# EasyEDA Pro project ESP32_Dev_Board.epro, board PCB4
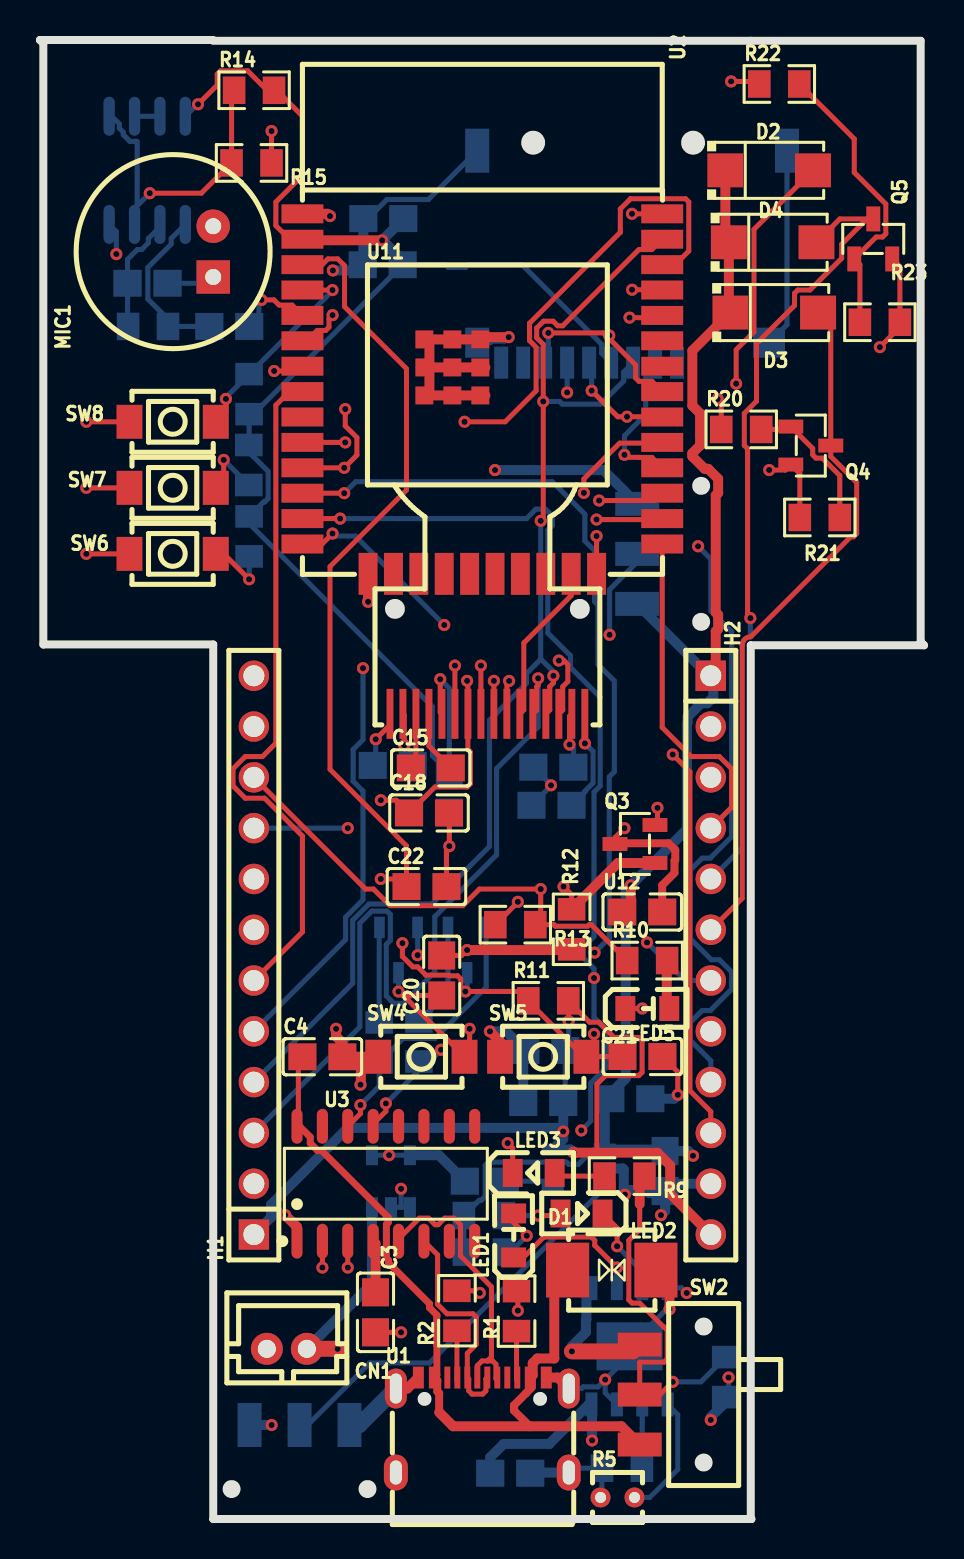
[diagram p1: board, top side]
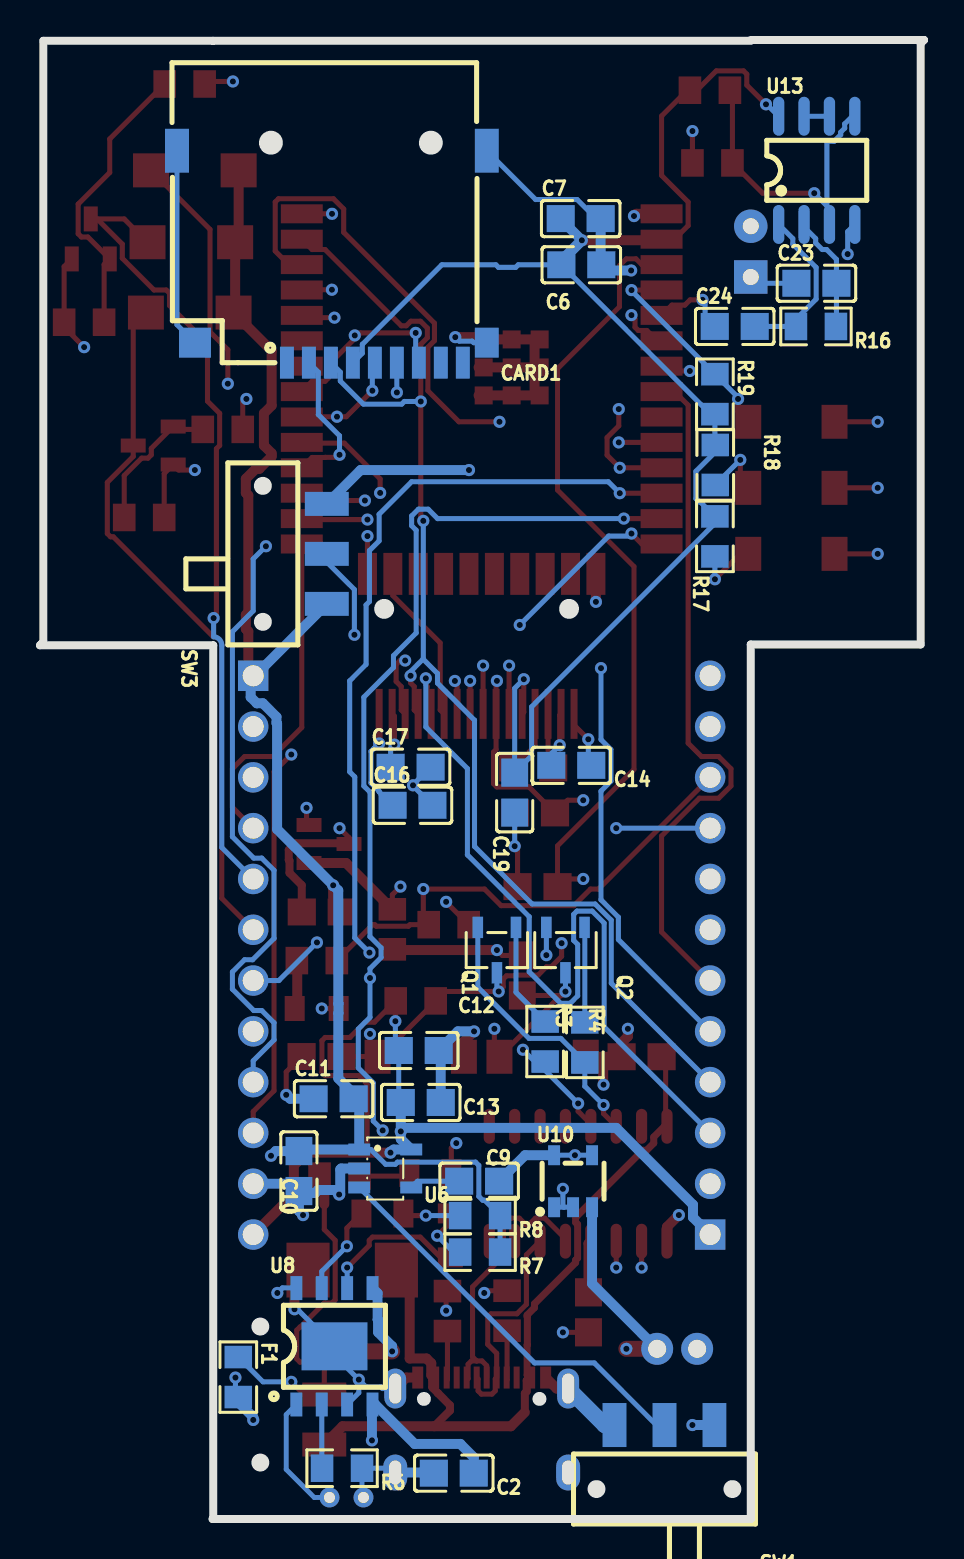
[diagram p2: board, bottom side, seen from below]

Outline 44.23 x 73.95 mm; copper layers: Top Layer, Inner1, Inner2, Bottom Layer. Coordinates in mm from the lower left corner of the outline.
Outline path: 8.67,73.95 0,73.95 0.17,73.79 0.17,43.73 8.67,43.73 8.67,0 35.59,0 35.56,0.03 35.56,43.69 44.23,43.69 44.06,43.86 44.06,73.91 8.67,73.91
Stack: Top Layer 0.035mm Outer layer thickness 1oz / Dielectric1 0.2104mm 7628 RC49% 8.6mil / Inner1 0.0152mm Inner layer thickness / Dielectric2 1.065mm 1.1mm H/HOZ Copper / Inner2 0.0152mm Inner layer thickness / Dielectric3 0.2104mm 7628 RC49% 8.6mil / Bottom Layer 0.035mm Outer layer thickness 1oz

## Design rules (mm)
template: JLCPCB Capability(Two Layers Board)
spacing copperThickness1oz (default): track to track 0.102, other pairs 0.152 to 0.3
spacing copperThickness2oz: track to track 0.203, other pairs 0.152 to 0.3
track width copperThickness1oz (default): min 0.127, default 0.254, max 2.54
track width copperThickness2oz: min 0.203, default 0.254, max 2.54
differential pair differentialPair (default): width min 0.127, default 0.254, max 2.54; gap min 0.152, default 0.152
via viaSize (default): diameter min 0.5, default 0.61, max 10; hole min 0.3, default 0.305, max 6.3

## Placement (name value [footprint] x y rotation side)
C2  22uF  [C0805]  23.52 2.29 0 bottom
C3  100nF  [C0805]  16.79 10.33 270 top
C4  100nF  [C0805]  14.13 23.11 0 top
C6  100uF  [C0805]  17.14 62.72 180 bottom
C7  100nF  [C0805]  17.18 65.02 180 bottom
C9  10nF  [C0805]  22.26 16.89 180 bottom
C10  22uF  [C0805]  31.27 17.4 90 bottom
C11  100nF  [C0805]  29.54 21.01 180 bottom
C12  22uF  [C0805]  25.28 23.43 0 bottom
C13  100nF  [C0805]  25.18 20.83 0 bottom
C14  100nF  [C0805]  17.65 37.68 0 bottom
C15  100nF  [C0805]  19.55 37.56 0 top
C16  4.7uF  [C0805]  25.59 35.69 180 bottom
C17  4.7uF  [C0805]  25.69 37.59 180 bottom
C18  100nF  [C0805]  19.46 35.31 0 top
C19  10uF  [C0805]  20.48 36.32 90 bottom
C20  100nF  [C0805]  20.1 27.18 90 top
C21  100nF  [C0805]  30.14 23.13 0 top
C22  100nF  [C0805]  19.34 31.62 0 top
C23  100nF  [C0805]  5.38 61.79 180 bottom
C24  1uF  [C0805]  9.47 59.63 180 bottom
CARD1  TF PUSH  [TF-SMD_TF-PUSH]  29.62 63.12 0 bottom
CN1  B2B-PH-K-S(LF)(SN)  [CONN-TH_B2B-PH-K-S]  12.35 8.51 0 top
D1  SMBJ5.0A  [DO-214AA_L4.4-W3.6-LS5.3-BI]  28.61 12.45 0 top
D2  SS14  [SMA_L4.4-W2.6-LS5.0-RD]  36.48 67.44 0 top
D3  SS14  [SMA_L4.4-W2.6-LS5.0-RD]  36.73 60.32 0 top
D4  SS14  [SMA_L4.4-W2.6-LS5.0-RD]  36.66 63.84 0 top
F1  BSMD-075-16V  [R0805]  34.31 7.1 270 bottom
H1  -  [HDR-TH_12P-P2.54-V-M]  10.7 28.19 90 top
H2  -  [HDR-TH_12P-P2.54-V-M]  33.56 28.19 270 top
LED1  -  [LED0805-RD_GREEN]  23.7 14.18 90 top
LED2  -  [LED0805-R-RD]  27.1 15.27 180 top
LED3  -  [LED0805-R-RD]  24.7 17.3 0 top
LED5  -  [LED0805-RD_GREEN]  30.38 25.53 0 top
MIC1  GMI9767P-50DB  [MIC-TH_BD9.7-P2.54-D0.8-L-FD]  8.67 63.37 90 top
Q1  BC817  [SOT-23-3_L2.9-W1.4-P1.91-LS2.6-BR]  21.37 28.45 90 bottom
Q2  BC817  [SOT-23-3_L2.9-W1.4-P1.91-LS2.6-BR]  17.94 28.45 90 bottom
Q3  AO3400A  [SOT-23-3_L2.9-W1.3-P1.90-LS2.4-BR]  29.77 33.75 0 top
Q4  AO3400A  [SOT-23-3_L2.9-W1.3-P1.90-LS2.4-BR]  38.56 53.68 180 top
Q5  AO3400A  [SOT-23-3_L2.9-W1.3-P1.90-LS2.4-BR]  41.69 64.01 270 top
R1  5.1K  [R0805]  23.84 10.4 90 top
R2  5.1K  [R0805]  20.86 10.41 90 top
R3  10K  [R0805]  18.95 23.88 90 bottom
R4  10K  [R0805]  16.97 23.83 90 bottom
R5  MF52A103J3950 (A1)  [RES-TH_L2.5-W2.5-P1.70-D0.3]  28.89 1.08 0 top
R6  2K  [R0805]  29.11 2.54 0 bottom
R7  1K  [R0805]  22.21 13.35 0 bottom
R8  1K  [R0805]  22.21 15.17 0 bottom
R9  1K  [R0805]  29.24 17.14 180 top
R10  1K  [R0805]  30.38 27.92 0 top
R11  10K  [R0805]  25.43 25.91 0 top
R12  10K  [R0805]  26.6 29.49 90 top
R13  100Ω  [R0805]  23.78 29.72 180 top
R14  10K  [R0805]  10.71 71.44 0 top
R15  10K  [R0805]  10.58 67.81 180 top
R16  100K  [R0805]  5.41 59.63 0 bottom
R17  10K  [R0805]  10.46 49.13 90 bottom
R18  10K  [R0805]  10.45 52.7 90 bottom
R19  10K  [R0805]  10.46 56.24 270 bottom
R20  100Ω  [R0805]  35.08 54.48 0 top
R21  10K  [R0805]  39.01 50.08 0 top
R22  100Ω  [R0805]  36.99 71.75 0 top
R23  10K  [R0805]  42.02 59.84 180 top
SW1  Slide Switch  [SW-SMD_3P-L9.1-W3.5-P2.50_MST-12D18G2]  12.99 4.7 0 bottom
SW2  Slide Switch  [SW-SMD_3P-L9.1-W3.5-P2.50_MST-12D18G2]  30 6.22 270 top
SW3  Slide Switch  [SW-SMD_3P-L9.1-W3.5-P2.50_MST-12D18G2]  29.88 48.26 90 bottom
SW4  BOOT  [KEY-SMD_L4.0-W3.0-LS4.9-1]  19.08 23.11 0 top
SW5  EN  [KEY-SMD_L4.0-W3.0-LS4.9-1]  25.18 23.11 0 top
SW6  EN  [KEY-SMD_L4.0-W3.0-LS4.9-1]  6.64 48.26 180 top
SW7  EN  [KEY-SMD_L4.0-W3.0-LS4.9-1]  6.64 51.56 180 top
SW8  EN  [KEY-SMD_L4.0-W3.0-LS4.9-1]  6.64 54.86 180 top
U1  USB-C  [USB-C-SMD_TYPE-C-6PIN-2MD-073]  22.13 4.7 0 top
U2  ESP32  [WIFI-SMD_ESP32-WROOM-32E]  22.13 56.26 270 top
U3  CH340C  [SOP-16_L10.0-W3.9-P1.27-LS6.0-BL]  17.3 16.76 0 top
U6  AP2210K-3.3TRE1  [SOT-23-5_L3.0-W1.7-P0.95-LS2.8-BR]  26.96 17.53 0 bottom
U8  TP4056-42-ESOP8  [ESOP-8_L4.9-W3.9-P1.27-LS6.0-BL-EP]  29.5 8.64 180 bottom
U10  LPB1003B5F  [SOT-23-5_L3.0-W1.6-P0.95-LS2.8-BL]  17.56 16.89 180 bottom
U11  X042-7240TSWPG01-H16  [OLED-SMD_16P-P0.65-X042-7240TSWPG01-H16]  22.38 40.26 0 top
U12  -  [C0805]  30.13 30.35 0 top
U13  LM358DR2G  [SOIC-8_L5.0-W4.0-P1.27-LS6.0-BL]  5.37 67.44 180 bottom

## Footprints (pads in the part's own frame, mm; a bottom-side part is the same pattern mirrored in y, then rotated)
C0805
  rect 1.41x1.35 smd: 1(-1,0) 2(1,0)
CONN-TH_B2B-PH-K-S
  round 1.6 hole 0.9: 1(1,0) 2(-1,0)
DO-214AA_L4.4-W3.6-LS5.3-BI
  rect 2.159x2.743 smd: 1(-2.21,0) 2(2.21,0)
ESOP-8_L4.9-W3.9-P1.27-LS6.0-BL-EP
  rect 0.6x1.2 smd: 1(-1.905,-2.909) 2(-0.635,-2.909) 3(0.635,-2.909) 4(1.905,-2.909) 5(1.905,2.909) 6(0.635,2.909) 7(-0.635,2.909) 8(-1.905,2.909)
  rect 3.3x2.4 smd: 9(0,0)
HDR-TH_12P-P2.54-V-M
  rect 1.524x1.524 hole 1.05: 1(-13.97,0)
  round 1.524 hole 1.05: 2(-11.43,0) 3(-8.89,0) 4(-6.35,0) 5(-3.81,0) 6(-1.27,0) 7(1.27,0) 8(3.81,0) 9(6.35,0) 10(8.89,0) 11(11.43,0) 12(13.97,0)
KEY-SMD_L4.0-W3.0-LS4.9-1
  rect 1.3x1.7 smd: 1(-2.159,0) 2(2.159,0)
LED0805-R-RD
  rect 1x1.399 smd: 1(1.05,0) 2(-1.05,0)
LED0805-RD_GREEN
  rect 1x1.25 smd: 1(-1.1,0) 2(1.1,0)
MIC-TH_BD9.7-P2.54-D0.8-L-FD
  rect 1.677x1.677 hole 0.8: 1(-1.27,0)
  round 1.677 hole 0.8: 2(1.27,0)
OLED-SMD_16P-P0.65-X042-7240TSWPG01-H16
  rect 0.35x2.5 smd: 1(-4.875,0) 2(-4.225,0) 3(-3.575,0) 4(-2.925,0) 5(-2.275,0) 6(-1.625,0) 7(-0.975,0) 8(-0.325,0) 9(0.325,0) 10(0.975,0) 11(1.625,0) 12(2.275,0) 13(2.925,0) 14(3.575,0) 15(4.225,0) 16(4.875,0)
R0805
  rect 1.133x1.377 smd: 1(-1,0) 2(1,0)
RES-TH_L2.5-W2.5-P1.70-D0.3
  round 1 hole 0.55: 1(-0.85,0) 2(0.85,0)
SMA_L4.4-W2.6-LS5.0-RD
  rect 1.8x1.7 smd: 1(-2.192,0) 2(2.192,0)
SOIC-8_L5.0-W4.0-P1.27-LS6.0-BL
  oval 0.569x1.95 smd: 1(-1.905,-2.705) 2(-0.635,-2.705) 3(0.635,-2.705) 4(1.905,-2.705) 5(1.905,2.705) 6(0.635,2.705) 7(-0.635,2.705) 8(-1.905,2.705)
SOP-16_L10.0-W3.9-P1.27-LS6.0-BL
  oval 0.56x1.745 smd: 1(-4.445,-2.873) 2(-3.175,-2.873) 3(-1.905,-2.873) 4(-0.635,-2.873) 5(0.635,-2.873) 6(1.905,-2.873) 7(3.175,-2.873) 8(4.445,-2.873) 9(4.445,2.873) 10(3.175,2.873) 11(1.905,2.873) 12(0.635,2.873) 13(-0.635,2.873) 14(-1.905,2.873) 15(-3.175,2.873) 16(-4.445,2.873)
SOT-23-3_L2.9-W1.3-P1.90-LS2.4-BR
  rect 1.25x0.7 smd: 1(1,-0.95) 2(1,0.95) 3(-1,0)
SOT-23-3_L2.9-W1.4-P1.91-LS2.6-BR
  rect 1.07x0.532 smd: 1(1.135,-0.955) 2(1.135,0.955) 3(-1.135,0)
SOT-23-5_L3.0-W1.6-P0.95-LS2.8-BL
  rect 0.6x1 smd: 1(-0.95,-1.3) 2(0,-1.3) 3(0.95,-1.3) 4(0.95,1.3) 5(-0.95,1.3)
SOT-23-5_L3.0-W1.7-P0.95-LS2.8-BR
  rect 1.1x0.6 smd: 1(1.3,-0.95) 2(1.3,0) 3(1.3,0.95) 4(-1.3,0.95) 5(-1.3,-0.95)
SW-SMD_3P-L9.1-W3.5-P2.50_MST-12D18G2
  rect 1.2x2.2 smd: 1(-2.5,0) 2(0,0) 3(2.5,0)
TF-SMD_TF-PUSH
  rect 0.7x1.6 smd: 1(2.25,5.3) 2(1.15,5.3) 3(0.05,5.3) 4(-1.05,5.3) 5(-2.15,5.3) 6(-3.25,5.3) 7(-4.35,5.3) 8(-5.45,5.3) CD(-6.55,5.3)
  rect 1.2x1.5 smd: 10(-7.75,4.3)
  rect 1.2x2.2 smd: 11(-7.75,-5.3) 12(7.75,-5.3)
  rect 1.6x1.5 smd: 13(6.85,4.3)
USB-C-SMD_TYPE-C-6PIN-2MD-073
  rect 0.55x1.1 smd: 1(-3.2,2.375) 2(-2.4,2.375) 11(2.4,2.375) 12(3.2,2.375)
  rect 0.3x1.1 smd: 3(-1.75,2.375) 4(-1.25,2.375) 5(-0.75,2.375) 6(-0.25,2.375) 7(0.25,2.375) 8(0.75,2.375) 9(1.25,2.375) 10(1.75,2.375)
  oval 1.1x2 hole 0.6x1.5: 13(-4.325,1.825) 14(4.325,1.825)
  oval 1.2x1.8 hole 0.6x1.2: 13(-4.325,-2.375) 14(4.325,-2.375)
WIFI-SMD_ESP32-WROOM-32E
  rect 0.95x2.1 smd: 1(-9.002,-9) 2(-7.732,-9) 3(-6.463,-9) 4(-5.192,-9) 5(-3.922,-9) 6(-2.652,-9) 7(-1.383,-9) 8(-0.113,-9) 9(1.157,-9) 10(2.428,-9) 11(3.697,-9) 12(4.968,-9) 13(6.237,-9) 14(7.508,-9) 25(7.508,9) 26(6.237,9) 27(4.968,9) 28(3.697,9) 29(2.428,9) 30(1.157,9) 31(-0.113,9) 32(-1.383,9) 33(-2.652,9) 34(-3.922,9) 35(-5.192,9) 36(-6.463,9) 37(-7.732,9) 38(-9.002,9)
  rect 2.1x0.95 smd: 15(9.002,-5.715) 16(9.002,-4.445) 17(9.002,-3.175) 18(9.002,-1.905) 19(9.002,-0.635) 20(9.002,0.635) 21(9.002,1.905) 22(9.002,3.175) 23(9.002,4.445) 24(9.002,5.715)
  rect 0.9x0.9 smd: 39(-2.721,-0.1) 39(-2.721,-1.5) 39(-2.721,-2.9) 39(-1.321,-0.1) 39(-1.321,-1.5) 39(-1.321,-2.9) 39(0.079,-0.1) 39(0.079,-1.5) 39(0.079,-2.9)

## Nets
As in the schematic.

Pads without a net: CARD1 1 8 CD; U1 3 9; U2 17 18 19 20 21 22 32; U3 7 8 9 10 11 12 15

## Via types
v1: diameter 0.61, hole 0.305, Top Layer to Bottom Layer, 125 vias

## Routing (per net, layer and track width the routed paths; a pad name or vN(x,y) marks a point on that pad's centre or on a via; arc(x,y) is an arc through that point)
+1.65V: length 15.7
  Top Layer w0.254: 9.58,71.7 R15.2 8.07,66.29 v1(5.49,66.29)
  Bottom Layer w0.254: v1(5.49,66.29) 4.86,65.66 ; 4.86,65.66 4.86,68.87 4.84,68.89 4.5,68.89 4.17,69.22 4.17,69.34 3.97,69.54 3.97,69.76 3.59,70.14 ; 4.86,65.66 4.73,65.53 U13.3
+3V3: length 156.9
  Top Layer w0.254: 26.45,25.89 27.5,24.84 27.96,24.84 28.72,24.08 29.96,24.08 30.12,23.92 30.12,22.33 29.96,22.17 28.29,22.17 27.86,21.74 27.86,18.32 ; 26.45,25.89 R11.2 ; 26.45,25.89 26.45,25.83 26.38,25.76 26.45,25.7 v1(26.45,24.89) ; 11.58,71.7 13.13,70.15 13.13,67.18 11.8,65.85 11.8,64.67 12.48,63.99 U2.2 ; U11.5 20.02,40.34 v1(20.02,41.99) ; v1(7.91,70.74) 8.87,71.7 8.87,72.25 9.03,72.41 10.39,72.41 11.36,71.44 R14.2 ; v1(21.37,41.91) 21.41,41.87 U11.7 21.41,38.48 21.54,38.35 21.54,36.77 21.37,36.6 19.76,36.6 C18.1 17.83,35.94 v1(17.05,35.94)
  Top Layer w0.5: v1(26.69,18.32) 30.89,18.32 31.53,17.68 31.53,16.26 H2.12 ; v1(17.12,63.94) 13.18,63.94 U2.2
  Inner2 w0.254: v1(21.37,41.91) 21.29,41.99 v1(20.02,41.99) ; v1(17.05,35.94) 20.55,32.44 20.55,24.12 21.23,23.44 22.9,23.44 24.64,25.18 26.16,25.18 v1(26.45,24.89)
  Bottom Layer w0.254: v1(20.02,41.99) 20.48,41.54 C19.2 19.63,38.17 19.63,40.61 10.46,49.78 R17.2 11.19,50.86 11.25,50.86 11.41,51.02 11.41,52.39 10.46,53.34 10.46,53.69 R18.2 10.46,53.72 R19.2 10.67,55.24 C6.1 20.3,62.72 20.43,62.59 21.29,62.59 21.42,62.72 24.12,62.72 28.1,58.73 28.1,58.29 CARD1.4 ; v1(26.45,24.89) 26.45,23.59 C12.2 26.28,20.93 C13.2 ; U13.8 7.87,70.74 v1(7.91,70.74)
  Bottom Layer w0.5: v1(26.69,18.32) 26.53,18.48 U6.5 26.18,19 v1(26.18,19.38) ; v1(17.12,63.94) 18.18,65 C7.1 ; v1(26.18,19.38) 26,19.56 15.4,19.56 11.56,15.72 11.56,15.08 H1.1 ; v1(26.18,19.38) C13.2
  Bottom Layer w0.54: C6.1 18.14,62.91 v1(17.12,63.94)
GND: length 402.9
  Top Layer w0.254: C21.2 31.91,22.36 v1(31.91,21.21) ; U11.6 v1(20.76,42.67) ; v1(30.89,35.56) 30.89,34.83 Q3.2 ; C18.2 20.48,35.29 v1(20.48,33.64) 20.34,33.5 C22.2 ; v1(21.37,28.45) 21.1,28.18 C20.2 ; v1(23.4,18.8) 23.65,18.55 23.65,17.3 ; R15.1 v1(11.58,69.4) ; LED5.1 v1(30.13,25.53) ; v1(36.48,52.45) 37.29,52.45 Q4.2 38.01,52.28 R21.1 ; Q5.2 43.02,62.63 R23.1 43.02,59.6 v1(42.02,58.6) ; C3.2 v1(18.07,9.33) ; U11.8 v1(22.06,42.67) ; 4.48,54.86 v1(2.32,54.86) ; v1(23.91,10.42) 23.91,11.33 R1.2 ; U2.38 v1(29.62,65.26) ; v1(22,11.3) 21.89,11.41 R2.2 ; v1(25.96,42.93) 26.21,42.93 26.41,42.73 26.41,41.88 26.16,41.62 26.16,40.45 U11.14 ; 4.48,51.56 v1(2.32,51.56) ; 4.48,48.26 v1(2.32,48.26)
  Top Layer w0.5: v1(31.5,10.49) 31.5,11.77 30.82,12.45 ; 19.48,57.58 19.48,56.18 U2.39 22.28,56.18 ; 19.48,57.58 22.28,57.58 ; 19.48,57.58 19.48,58.98 U2.39 22.28,58.98 22.4,59.1 v1(23.45,59.1) ; SW5.1 23.02,23.88 v1(22.51,24.38) ; U2.1 14.4,65.26 v1(14.51,65.15) ; v1(12.27,15.2) 12.86,14.6 U3.1 ; v1(16.41,45.86) U2.15 ; v1(14.81,24.51) 14.81,24.13 15.13,23.82 C4.2 16.05,23.11 ; 26.45,6.52 25.91,7.07 U1.12 ; 16.05,23.11 16.05,21.74 v1(16.03,21.72) ; 16.05,23.11 SW4.1 ; R12.1 26.56,28.45 v1(21.37,28.45) ; U1.1 18.38,6.52 17.8,6.52
  Inner1 w0.254: v1(26.37,56.33) 25.76,55.72 25.76,55.64 25.42,55.3 25.34,55.3 23.42,53.38 19.48,53.38 ; v1(12.27,15.2) 12.27,13.42 13.7,11.99 15.41,11.99 v1(18.07,9.33) ; 19.48,53.38 20.41,52.45 v1(22.76,52.45) v1(36.48,52.45) 42.02,57.99 v1(42.02,58.6) ; 19.48,53.38 18,54.86 v1(2.32,54.86) v1(2.32,51.56) v1(2.32,48.26) ; v1(20.76,42.67) v1(22.06,42.67) 22.31,42.93 v1(25.96,42.93) ; MIC1.2 14,64.64 v1(14.51,65.15) 14.51,66.48 v1(11.58,69.4)
  Inner1 w0.5: MIC1.2 7.27,63.25 v1(3.82,63.25) ; v1(16.03,21.72) 17.38,21.72 18.61,20.48 ; v1(23.91,10.42) 22.82,9.33 ; 22.82,9.33 22,10.15 v1(22,11.3) ; 22.82,9.33 v1(18.07,9.33) 18.07,6.78 17.8,6.52 17.8,2.32 U1.14 26.45,6.52 ; 31.91,18.87 30.13,20.65 v1(30.13,25.53) ; 31.91,18.87 v1(29.26,16.22) ; 31.91,18.87 v1(31.91,21.21) ; 27.34,35.69 26.34,36.69 v1(25.57,36.69) ; 20.73,22.61 v1(22.51,24.38) 22.51,27.3 v1(21.37,28.45) 21.37,29.34 30.77,38.74 ; 20.73,22.61 22,21.34 22,20.19 v1(23.4,18.8) ; 20.73,22.61 18.61,20.48 ; 14.64,31.73 14.64,35.69 H1.11 10.7,40.09 16.41,45.81 ; 14.64,31.73 14.64,24.69 v1(14.81,24.51) ; 14.64,31.73 16.55,33.64 v1(20.48,33.64) ; 30.77,38.74 31.66,39.62 H2.2 ; 30.77,38.74 30.77,35.68 v1(30.89,35.56) ; v1(17.46,18.19) 17.46,18.38 16.99,18.86 ; v1(14.51,65.15) 14.65,65.01 v1(14.65,62.43) 19.48,57.6 19.48,55.13 ; 18.61,20.48 16.99,18.86 ; v1(20.76,42.67) 20.5,42.93 18.59,42.93 16.41,45.1 16.41,45.81 ; 16.99,18.86 13.32,15.2 v1(12.27,15.2) 10.7,16.76 ; 16.41,45.81 v1(16.41,45.86) 19.48,48.93 19.48,55.13 ; v1(29.62,65.26) v1(23.45,59.1) 19.48,55.13
  Inner1 w0.8: v1(31.5,10.49) 31.07,10.92 v1(31.07,15.2)
  Bottom Layer w0.254: C7.2 16.4,65.02 17.36,65.98 19.43,65.98 CARD1.11 ; U10.4 v1(17.46,18.19) U10.5 ; CARD1.6 v1(26.37,56.33) ; v1(28.28,6.97) 27.91,6.61 27.18,6.61 27.09,6.52 26.45,6.52 ; v1(28.28,6.97) 29.5,8.19 U8.9 31.35,10.49 v1(31.5,10.49) ; v1(28.28,6.97) 28.28,6.31 U8.3 ; v1(3.82,63.25) 3.82,64.37 U13.4 ; CARD1.10 22.53,58.82 22.61,58.9 23.25,58.9 v1(23.45,59.1) ; R5.1 28.11,1.15 R6.1 26.67,2.54 U1.14 ; C16.2 25.57,36.66 v1(25.57,36.69) 25.57,36.71 C17.2 ; C19.1 v1(20.48,33.64)
  Bottom Layer w0.5: C2.2 24.56,2.32 U1.14 ; v1(22.76,52.45) 28.19,52.45 SW3.3 ; C6.2 16.18,62.75 C7.2 ; v1(31.91,21.21) 31.71,21.01 C11.1 ; 16.41,62.74 16.11,62.43 v1(14.65,62.43) ; v1(22.51,24.38) 23.32,24.38 C12.1 24.18,23.32 C13.1 ; U10.5 19.96,18.19 C9.2 ; C10.1 31.64,16.76 33.56,16.76 ; C10.1 31.27,15.4 v1(31.07,15.2) ; C10.1 31.17,16.3 30.47,16.3 30.32,16.45 29.49,16.45 v1(29.26,16.22) ; 29.21,16.22 29.21,17.48 29.16,17.53 U6.2
  Bottom Layer w0.8: SW1.3 15.98,4.7 17.8,6.52
VIN: length 165.5
  Top Layer w0.5: U12.1 29.56,30.78 v1(29.56,31.69) ; 33.56,42.16 33.81,42.41 33.81,44.38 33.93,44.51 33.93,45.21 33.81,45.34 33.81,51.18 33.93,51.31 33.93,52.01 33.43,52.51 33.26,52.51 32.64,53.13 32.64,53.29 33.02,53.68 33.02,55.29 32.64,55.67 32.64,58.42 D3.1 34.46,60.4 D4.1 34.29,64.02 D2.1
  Inner2 w0.35: 10.7,42.16 10.7,41.1 10.63,41.1 9.18,39.64 9.18,29.08 10.17,28.09 11.18,28.09 11.86,27.41 11.86,16.28 11.74,16.16 11.74,16.15 10.97,15.39 9.77,15.39 9.54,15.15 9.54,14.98 9.3,14.75 9.3,7.75 10.7,6.35 10.7,5.59 v1(11.59,4.7)
  Inner2 w0.5: v1(32.67,18.16) 32.42,18.16 32.16,17.91 32.16,13.97 32.26,13.87 32.26,13.79 32.88,13.18 32.95,13.18 34.19,11.94 34.19,7.33 v1(34.45,7.07)
  Inner2 w0.8: v1(11.59,4.7) 12.36,3.93 v1(27.62,3.93) 32.54,3.93 v1(33.56,4.95)
  Bottom Layer w0.254: U6.1 27.68,18.48 26.93,17.73 26.45,17.73 26.34,17.84 22.44,17.84 22.27,17.68 22.27,16.13 22.08,15.94 21.97,15.94 R8.1 R7.1 ; v1(34.45,7.07) 34.45,6.22 34.32,6.1
  Bottom Layer w0.5: SW3.1 33.47,42.16 33.56,42.16 33.69,42.04 33.69,41.1 33.38,40.79 33.08,40.79 32.4,40.11 32.4,39.8 32.37,39.77 32.37,34.49 v1(29.56,31.69) 29.31,31.43 29.31,25.78 29.29,25.77 29.29,25.28 29.31,25.27 29.31,22.04 28.54,21.27 C11.2 28.26,20.73 U6.1 30.72,18.48 30.77,18.53 ; v1(33.56,4.95) 33.56,5.1 34.43,5.97 ; v1(27.62,3.93) 27.62,5.7 U8.4 27.45,5.73 25.48,3.75 23.2,3.75 22.52,3.08 C2.1 ; v1(32.67,18.16) 32.43,18.4 C10.2 ; SW1.1 v1(11.59,4.7)
BAT+: length 28.8
  Top Layer w0.8: v1(26.61,8.38) 29.66,8.38 SW2.1 ; CN1.1 v1(14.89,8.51)
  Inner2 w0.8: v1(26.61,8.38) 15.02,8.38 v1(14.89,8.51)
  Bottom Layer w0.5: U10.3 16.61,11.77 CN1.1 ; U8.5 27.34,11.29 27.34,9.98 27.31,9.95 27.31,9.34 26.61,8.64 v1(26.61,8.38)
CE: length 52.1
  Inner2 w0.254: v1(32.35,11.3) 28.5,15.16 28.5,22.65 27.13,24.02 27.13,25.18 26.78,25.54 24.49,25.54 22.75,23.8 22.27,23.8 22.14,23.93 21.25,23.93 20.91,24.27 20.91,24.75 28.5,32.34 v1(28.5,44.21)
  Bottom Layer w0.254: SW3.2 29.88,47.85 28.5,46.48 v1(28.5,44.21) ; 31.4,11.56 32.1,11.56 v1(32.35,11.3)
D+: length 14.1
  Top Layer w0.254: U3.5 17.94,14 18.98,15.04 19.44,15.04 19.77,14.72 19.92,14.72 20.25,15.04 20.71,15.04 21.04,14.72 21.04,13.16 22.59,11.61 22.59,8.11 22.38,7.9 ; 22.38,7.9 22.11,7.9 21.88,7.67 U1.6 ; 22.38,7.9 22.65,7.9 22.81,7.74 22.81,7.02 22.88,6.95
D-: length 11.2
  Top Layer w0.254: U1.7 22.31,7 22.31,6.41 22.15,6.25 21.61,6.25 21.45,6.41 21.45,7 U1.5 21.38,8.28 21.83,8.73 21.83,10.1 21.66,10.26 20.37,10.26 19.89,10.73 19.89,13.21 U3.6
DC: length 8.1
  Top Layer w0.254: U11.11 24.2,40.45 24.2,43.81 26.57,46.18 U2.23
ESP-EN: length 75.4
  Top Layer w0.25: C22.1 18.34,33.66 14.51,37.48 14.51,47.62 18.34,51.45 18.34,57.52 15.24,60.62 15.24,62.67 14.89,63.01 14.41,63.01 14.12,62.72 U2.3
  Top Layer w0.254: C22.1 17.95,32 v1(17.05,32) ; 27.21,23.11 23.95,26.38 v1(21.28,26.38) 21.05,26.6 21.05,27 20.89,27.16 20.49,27.16 20.46,27.19 19.31,27.19 18.89,27.61 18.65,27.61 18.13,28.13 v1(18.13,28.79) ; 27.35,23.13 SW5.2 ; 27.35,23.13 C21.1 ; 27.35,23.13 27.72,23.49 v1(27.72,24.26)
  Inner2 w0.254: H2.3 33.56,36.02 34.6,34.97 34.6,34.11 33.53,33.05 33.13,33.05 32.52,32.43 32.52,29.06 v1(27.72,24.26) ; v1(18.13,28.79) 18.13,30.92 v1(17.05,32)
  Bottom Layer w0.254: v1(21.28,26.38) 21.37,26.47 Q1.3
ESP-IO0: length 42
  Top Layer w0.254: 33.56,34.54 34.6,35.58 34.6,37.52 33.99,38.12 32.58,38.12 31.13,39.58 U2.25 ; 18.18,26.18 18.13,26.18 v1(17.94,26.37) ; 18.18,26.18 SW4.2 21.49,23.37 v1(21.49,24.51) ; 18.18,26.18 19.97,26.18
  Inner2 w0.254: v1(21.49,24.51) 31.53,34.54 33.56,34.54
  Bottom Layer w0.254: v1(17.94,26.37) Q2.3
ESP-IO2: length 45.1
  Top Layer w0.254: 25.05,31.24 25.05,29.99 R13.1 25.72,29.72 25.8,29.64 27.4,29.64 27.48,29.72 27.58,29.72 R10.1 ; U2.24 v1(27.84,49.15) ; v1(25.05,31.5) 21.99,31.5 21.16,30.67 17.52,30.67 16.68,31.5 16.28,31.5 H1.10
  Inner2 w0.254: v1(25.05,31.5) 27.84,34.29 v1(27.84,49.15)
ESP-IO5: length 40.9
  Top Layer w0.254: v1(31.66,38.23) 32.52,37.36 32.52,21.41 33.56,20.37 H2.10 ; v1(27.21,51.31) 27.21,52.01 29,53.8 31.09,53.8 U2.29
  Inner2 w0.254: v1(27.21,51.31) 27.53,51.31 27.73,51.51 28.21,51.51 28.56,51.17 28.56,49.96 31.66,46.86 v1(31.66,38.23)
ESP-IO12: length 59.4
  Top Layer w0.254: U2.14 14.11,48.75 v1(14.64,49.28)
  Inner2 w0.254: v1(20.22,44.7) 20.22,45.47 24.08,49.33 25.29,49.33 25.63,49.67 25.63,50.88 26.95,52.2 28.03,52.2 28.91,51.32 28.91,50.24 30.51,48.64 v1(32.92,48.64)
  Bottom Layer w0.254: v1(32.92,48.64) 33.56,48.01 33.56,45.41 34.6,44.37 34.6,34.11 33.53,33.05 33.13,33.05 32.52,32.43 32.52,29.03 33.59,27.96 33.99,27.96 34.6,27.35 34.6,26.49 33.53,25.42 33.13,25.42 32.52,24.81 32.52,23.95 33.56,22.91 H2.9 ; 14.64,49.15 15.78,49.15 v1(20.22,44.7)
ESP-IO14: length 75.6
  Top Layer w0.254: U2.13 v1(15.02,50.02)
  Inner2 w0.254: v1(27.08,19.43) 28.14,18.37 28.14,15.01 28.35,14.8 28.35,13.94 28.29,13.88 28.29,12.83 28.28,12.81 28.28,12.33 28.62,11.99 30.84,11.99 32.11,10.72 32.59,10.72 32.94,11.06 32.94,11.54 29.85,14.64 29.85,16.47 29.5,16.81 29.5,20.33 33.56,24.38
  Bottom Layer w0.254: v1(15.02,50.02) 24.34,50.02 24.81,50.49 25.29,50.49 25.63,50.15 25.63,49.67 25.41,49.44 25.41,44.3 26.54,43.17 26.54,42.58 28.03,41.09 28.03,36.65 27.72,36.35 27.72,29.12 27.16,28.56 27.16,28.08 27.72,27.52 v1(27.72,27.05) 27.72,25.08 28.3,24.5 28.3,22.55 27.55,21.8 27.55,19.9 v1(27.08,19.43)
ESP-IO22: length 54.8
  Top Layer w0.254: v1(21.24,54.86) 23.27,54.86 24.82,56.42 24.82,58.59 24.49,58.92 24.49,59.8 29.03,64.34 29.03,65.51 29.55,66.02 32.3,66.02 32.46,65.85 32.46,63.4 31.78,62.72 U2.36
  Inner2 w0.254: 10.7,29.46 10.7,30.53 9.66,31.57 9.66,32.43 10.27,33.05 10.67,33.05 11.74,34.11 11.74,42.59 10.7,43.64 10.7,44.32 v1(21.24,54.86)
ESP-IO25: length 30.4
  Top Layer w0.254: U2.10 v1(15.27,53.83) ; R20.1 34.08,55.82 v1(33.9,56.01)
  Inner2 w0.254: v1(33.9,56.01) 30.08,59.83 30.08,60.15 30.56,60.63 30.56,61.86 30.01,62.41 27.69,62.41 19.12,53.83 v1(15.27,53.83)
ESP-IO26: length 33.1
  Top Layer w0.254: v1(34.58,71.88) 35.86,71.88 R22.1 ; v1(15.27,55.5) 15.27,54.66 15.86,54.08 15.86,53.2 v1(15.22,52.56) U2.11
  Inner2 w0.254: v1(34.58,71.88) 32.39,69.7 32.31,69.7 31.79,69.18 31.79,69.1 18.19,55.5 v1(15.27,55.5)
ESP-IO27: length 44.8
  Top Layer w0.254: U2.12 v1(15.22,51.29)
  Inner2 w0.254: v1(27.74,28.32) 28.25,28.83 v1(30.37,28.83)
  Bottom Layer w0.254: v1(15.22,51.29) 15.79,51.87 25.63,51.87 27.26,50.24 27.26,48.91 27.74,48.42 27.74,45.87 27.91,45.71 27.91,42.73 28.73,41.91 28.73,37.36 28.48,37.11 28.48,29.06 v1(27.74,28.32) ; H2.7 32.28,26.92 v1(30.37,28.83)
ESP-IO32: length 34.8
  Top Layer w0.254: H1.6 13.13,29.35 13.13,34.15 11.24,36.04 10.27,36.04 9.66,36.65 9.66,37.52 10.27,38.12 11.13,38.12 11.8,38.79 11.8,55.69 12.48,56.37 U2.8
ESP-IO34: length 20.6
  Top Layer w0.254: v1(14.64,60.2) 14.46,60.02 14.46,59.59 14.3,59.43 13.87,59.43 13.35,58.91 U2.6 ; v1(10.46,46.99) 9.19,48.26 SW6.1
  Inner2 w0.254: v1(10.46,46.99) 14.64,51.16 v1(14.64,60.2)
  Bottom Layer w0.254: R17.1 v1(10.46,46.99)
ESP-IO35: length 10.3
  Top Layer w0.254: v1(11.72,57.4) 12.89,57.4 U2.7 ; SW7.1 9.19,51.96 v1(9.19,52.96)
  Inner2 w0.254: v1(9.19,52.96) 11.72,55.48 v1(11.72,57.4)
  Bottom Layer w0.254: R18.1 v1(9.19,52.96)
ESP-IO36: length 10.5
  Top Layer w0.254: U2.4 13.13,61.45 v1(14.63,61.45) ; v1(9.3,56.01) 9.3,55.37 SW8.1
  Bottom Layer w0.254: v1(9.3,56.01) 9.3,56.09 R19.1 14.63,61.42 v1(14.63,61.45)
ESP-IO39: length 3.9
  Top Layer w0.254: v1(11.08,60.96) 11.7,60.96 11.96,60.7 12.61,60.7 U2.5
  Bottom Layer w0.254: C24.1 10.95,60.12 10.95,60.96
ESP-RX: length 65.2
  Top Layer w0.254: U2.34 31.02,60.07 v1(29.5,60.07) ; U3.2 v1(14.13,12.57)
  Inner2 w0.254: v1(29.5,60.07) 30.21,60.78 30.21,61.71 29.86,62.05 29.38,62.05 14.13,46.8 14.13,31.84 ; v1(14.13,12.57) 14.13,31.84 ; 14.13,31.84 13.96,32 H1.8
ESP-TX: length 62.3
  Top Layer w0.254: U3.3 v1(15.4,12.57) ; U2.35 31.12,61.47 v1(29.62,61.47)
  Inner2 w0.254: v1(15.4,12.57) v1(15.4,34.55) 15.4,47.24 v1(29.62,61.47)
  Bottom Layer w0.254: v1(15.4,34.55) 10.7,34.55
IO25-I+: length 34.8
  Top Layer w0.254: 33.56,29.46 35.13,31.04 35.13,43.69 arc(35.26,43.99) 35.56,44.11 40.56,49.11 40.69,49.11 40.86,49.28 40.86,51.83 39.56,53.13 Q4.3 39.56,59.69 D3.2
IO26-I+: length 40.2
  Top Layer w0.254: Q5.3 41.37,65.01 ; 41.37,65.01 40.02,65.01 D4.2 ; 41.37,65.01 40.11,63.75 40.11,63.04 38.52,61.45 37.91,61.45 37.75,61.29 37.75,60.68 35.85,58.78 35.85,55.9 35.24,55.29 35.24,53.68 35.4,53.52 35.4,45.19 v1(35.54,45.05)
  Bottom Layer w0.254: v1(35.54,45.05) 35.54,44.11 arc(35.25,43.98) 35.13,43.69 35.13,33.58 H2.5
MISO: length 51.4
  Top Layer w0.254: U2.31 30.61,56.89 29.96,56.89 29.8,57.05 29.8,57.7 28.19,59.31 v1(25.43,59.31)
  Inner2 w0.254: v1(16.16,42.55) 28.48,54.86 v1(28.48,59.18)
  Bottom Layer w0.254: v1(16.16,42.55) 16.16,38.97 15.66,38.48 15.66,36.89 16.16,36.4 16.16,30.96 15.29,30.09 15.29,28.97 10.7,24.38 ; CARD1.7 25.43,57.98 v1(25.43,59.31)
MOSI: length 62.8
  Top Layer w0.254: U11.13 25.5,40.45 25.5,41.62 25.69,41.81 v1(25.69,42.16) ; U2.37 30.61,63.48 29.96,63.48 26.15,59.66 25.9,59.66 25.67,59.89 25.19,59.89 24.85,59.55 24.85,59.07 25.18,58.74 v1(25.18,55.88) 25.18,50.04 v1(25.05,49.91)
  Bottom Layer w0.254: 25.05,43.01 25.69,42.37 v1(25.69,42.16) ; 25.05,43.01 v1(25.05,49.91) ; 25.05,43.01 25.05,42.99 24.34,42.28 24.34,41.8 22.49,39.94 22.49,33.63 19.61,30.75 16.45,30.75 15.65,29.94 15.65,26.79 H1.4 ; v1(25.18,55.88) 26,55.88 26.13,55.75 28.05,55.75 29.2,56.9 29.2,57.35 CARD1.3
OLED_CS#: length 16.2
  Top Layer w0.254: U11.9 v1(22.71,41.91) ; U2.27 30.76,50.93 v1(27.97,50.93)
  Inner2 w0.254: v1(27.97,50.93) 24.54,47.5 24.54,44.83 22.71,43 v1(22.71,41.91)
RES#: length 14.9
  Top Layer w0.254: v1(27.84,49.97) 31.08,49.97 U2.26 ; v1(23.47,41.91) 23.36,41.79 U11.10
  Inner2 w0.254: v1(23.47,41.91) 26.23,44.67 26.23,48.36 v1(27.84,49.97)
SCK: length 69.6
  Top Layer w0.254: v1(27.6,56.42) 28.9,55.12 v1(29.37,55.12) 31.12,55.12 U2.30 ; U11.12 24.85,40.45 24.85,41.62 24.92,41.69 v1(24.92,42.04)
  Inner2 w0.254: v1(29.37,55.12) 19.44,45.19 19.44,41.75 19.78,41.41 21.04,41.41 21.13,41.33 23.22,41.33 23.23,41.32 24.21,41.32 v1(24.92,42.04)
  Bottom Layer w0.254: H1.3 16,24.61 16,29.8 16.6,30.4 17.37,30.4 17.53,30.23 17.53,28.93 17.33,28.73 17.33,26.16 17.7,25.79 18.18,25.79 19.75,27.36 19.75,30.12 22.84,33.21 22.84,37.52 24.92,39.6 v1(24.92,42.04) ; v1(27.6,56.42) 27.6,57.69 CARD1.5
SD_CS#: length 7.5
  Top Layer w0.254: U2.28 30.61,53.08 29.96,53.08 29.96,53.09 29.11,53.09
  Bottom Layer w0.254: v1(29.24,53.21) 29.24,54.16 30.3,55.22 30.3,57.35 CARD1.2
USB+: length 41
  Top Layer w0.254: 12.93,19.98 12.93,22.79 13,22.86
  Top Layer w0.35: U3.16 12.99,19.64 13.52,19.1 13.52,18.79 13.88,18.44 14.07,18.44 17.43,15.08 17.43,14.83 17.33,14.74 17.33,13.05 17.43,12.95 17.43,12.82 19.49,10.76 19.49,10.56 19.86,10.2 19.86,10.13 19.84,10.12 19.84,8.71 19.86,8.7 19.86,7.2 U1.2
  Top Layer w0.4: U1.11 24.59,7.01 24.59,6.57 24.32,6.29 24.32,6.29 23.72,5.69 23.72,5.42 24.5,4.64 ; 19.97,5.33 19.97,6.29 19.88,6.38 19.88,6.93 U1.2
  Top Layer w0.5: SW2.3 29.09,4.64 20.67,4.64 19.97,5.33 ; D1.1 25.73,11.78 25.73,8.03 24.89,8.03 24.65,7.79 24.65,7.2 U1.11
$1N1664: length 2.5
  Top Layer w0.254: 23.88,6.95 23.84,6.98 R1.1
$1N1690: length 2.5
  Top Layer w0.254: R2.1 20.86,6.97 20.88,6.95
$1N3674: length 13.7
  Top Layer w0.254: U3.14 16.03,20.27 v1(16.03,20.7)
  Bottom Layer w0.254: v1(16.03,20.7) 16.97,21.64 R4.1 18.17,24.03 19.76,24.03 22.32,26.59 Q1.2
$1N3702: length 12.1
  Top Layer w0.254: 16.67,19.64 16.67,19.75 17.3,20.38 v1(17.3,20.78)
  Inner2 w0.254: v1(20.07,23.46) 18.89,24.63 v1(18.89,28.19)
  Bottom Layer w0.254: v1(17.3,20.78) 18.95,22.43 R3.1 19.48,22.88 v1(20.07,23.46) ; Q2.2 v1(18.89,28.19)
$1N3778: length 5.3
  Bottom Layer w0.254: R3.2 20.41,26.33 Q1.1
$1N3782: length 4.8
  Bottom Layer w0.254: Q2.1 16.97,29.57 R4.2
$1N3890: length 2.6
  Top Layer w0.5: 16.67,13.89 16.79,13.77 C3.1
$1N5276: length 2.5
  Bottom Layer w0.254: U6.4 25.34,16.89 C9.1
$1N5341: length 20.2
  Bottom Layer w0.254: SW1.2 13.39,4.7 16.5,7.8 19.48,7.8 U6.3
$1N6158: length 18.6
  Top Layer w0.254: 30,15.74 30,14.48 29.46,13.93 29.46,10.96 29.62,10.8 30,10.8 31.2,9.6 31.22,9.6 31.38,9.44 31.38,8.01 31.22,7.84 30.01,7.84 30,7.83 SW2.2 31.02,6.22 v1(31.66,6.86)
  Top Layer w0.5: R9.1 30,16.91 30,15.74
  Bottom Layer w0.254: F1.1 33.07,6.86 v1(31.66,6.86)
$1N7611: length 6.2
  Bottom Layer w0.248: R5.2 30.51,1.08 31.91,2.48 31.91,5.22 U8.1
$1N7665: length 3.2
  Bottom Layer w0.254: 30.13,5.73 30.13,2.56 R6.2
$1N7714: length 7.4
  Top Layer w0.254: v1(28.86,12.57) 27.76,13.68 27.76,13.93 27.59,14.1 25.2,14.1 24.19,13.08 23.7,13.08
  Bottom Layer w0.254: U8.6 v1(28.86,12.57)
$1N7763: length 2.9
  Top Layer w0.254: 23.7,15.28 23.7,14.82 v1(24.36,14.16)
  Bottom Layer w0.254: v1(24.36,14.16) 23.54,13.35 R7.2
$1N7878: length 4.6
  Top Layer w0.254: LED2.2 28.87,14.55 v1(28.87,13.64)
  Bottom Layer w0.254: v1(28.87,13.64) 30.13,12.38 30.13,11.54
$1N7880: length 2.9
  Top Layer w0.254: v1(24.92,15.17) 25.94,15.17 26.05,15.27
  Bottom Layer w0.254: R8.2 v1(24.92,15.17)
$1N8003: length 2.6
  Top Layer w0.254: R9.2 25.91,17.14 LED3.1
$1N10148: length 13.6
  Inner2 w0.5: CN1.2 12.15,8.51 12.15,9.01 12.85,9.71 13.68,9.71 18.07,14.1 v1(18.07,16.51)
  Bottom Layer w0.254: U10.2 18.02,15.59 ; 18.02,15.59 U10.1 ; 18.02,15.59 18.07,15.63 v1(18.07,16.51)
$1N11462: length 2.9
  Top Layer w0.254: U11.1 17.51,39.7 v1(16.8,38.99)
  Bottom Layer w0.254: v1(16.8,38.99) 16.8,37.83 C14.1
$1N11466: length 2.8
  Top Layer w0.254: U11.2 18.22,40.19 v1(18.22,38.69)
  Bottom Layer w0.254: v1(18.22,38.69) 18.65,38.27 C14.2
$1N11493: length 2.8
  Top Layer w0.254: U11.3 18.81,37.81 C15.1
$1N11497: length 3.2
  Top Layer w0.254: C15.2 19.46,38.65 U11.4
$1N13259: length 5.2
  Top Layer w0.254: U11.16 27.26,40.26 v1(27.26,38.78)
  Bottom Layer w0.254: v1(27.26,38.78) 27.5,38.55 27.51,38.55 27.67,38.38 27.67,36.8 27.26,36.39 27.26,36.36 C16.1
$1N14442: length 2.8
  Top Layer w0.254: v1(26.49,38.72) 26.49,40.14 U11.15
  Bottom Layer w0.254: v1(26.49,38.72) 26.69,38.53 C17.1
$1N14768: length 2.4
  Top Layer w0.5: 31.36,25.53 31.36,27.9 R10.2
$1N16929: length 10.6
  Top Layer w0.254: R13.2 23.91,30.84 v1(23.91,30.86) ; v1(26.19,31.62) 26.6,31.22 R12.2
  Top Layer w0.5: Q3.1 28.92,32.8 R12.2
  Inner2 w0.254: v1(26.19,31.62) 25.43,30.86 v1(23.91,30.86)
$1N16963: length 44.9
  Top Layer w0.254: v1(34.83,56.77) 34.83,58.47 35.72,59.36 35.72,64.48 D2.2 ; v1(29.24,34.54) 28.77,34.07 Q3.3
  Top Layer w0.4: Q3.3 28.8,33.79 31.45,33.79 31.78,33.46 31.78,32.96 31.74,32.92 31.74,32.31 31.13,31.69 U12.2
  Inner2 w0.254: v1(29.24,34.54) 30.31,35.61 30.31,35.8 30.65,36.14 30.84,36.14 33.28,38.58 33.99,38.58 34.83,39.42 v1(34.83,56.77)
$1N17452: length 10
  Bottom Layer w0.254: CARD1.13 37.37,59.72 CARD1.12
$1N20706: length 1.3
  Bottom Layer w0.254: U13.6 U13.7
$1N21042: length 2.4
  Bottom Layer w0.254: MIC1.1 8.36,61.79 C23.1
$1N21070: length 6
  Bottom Layer w0.254: R16.1 4.38,59.66 C23.2 4.38,62.98 4.87,63.48 5.09,63.48 5.42,63.81 5.42,64.02 6.13,64.73
$1N21124: length 8.4
  Bottom Layer w0.254: U13.1 6.56,64.02 6.56,63.75 5.4,62.58 5.4,61 6.41,59.99 6.41,59.93 6.35,59.88 6.41,59.82 R16.2 C24.2
$1N31105: length 7.3
  Top Layer w0.254: R21.2 40.01,52.18 39.14,53.05 38.82,53.05 38.66,53.21 38.66,53.53 37.56,54.63 37.42,54.48 R20.2
$1N31458: length 14.7
  Top Layer w0.254: R22.2 40.74,69.01 40.74,67.33 42.32,65.75 42.32,64.27 42.15,64.1 41.83,64.1 Q5.1 41.02,62.73 R23.2
